# Altium schematic sheet Peripherals.SchDoc
size A3; SheetNumber: 3; SheetTotal: 5
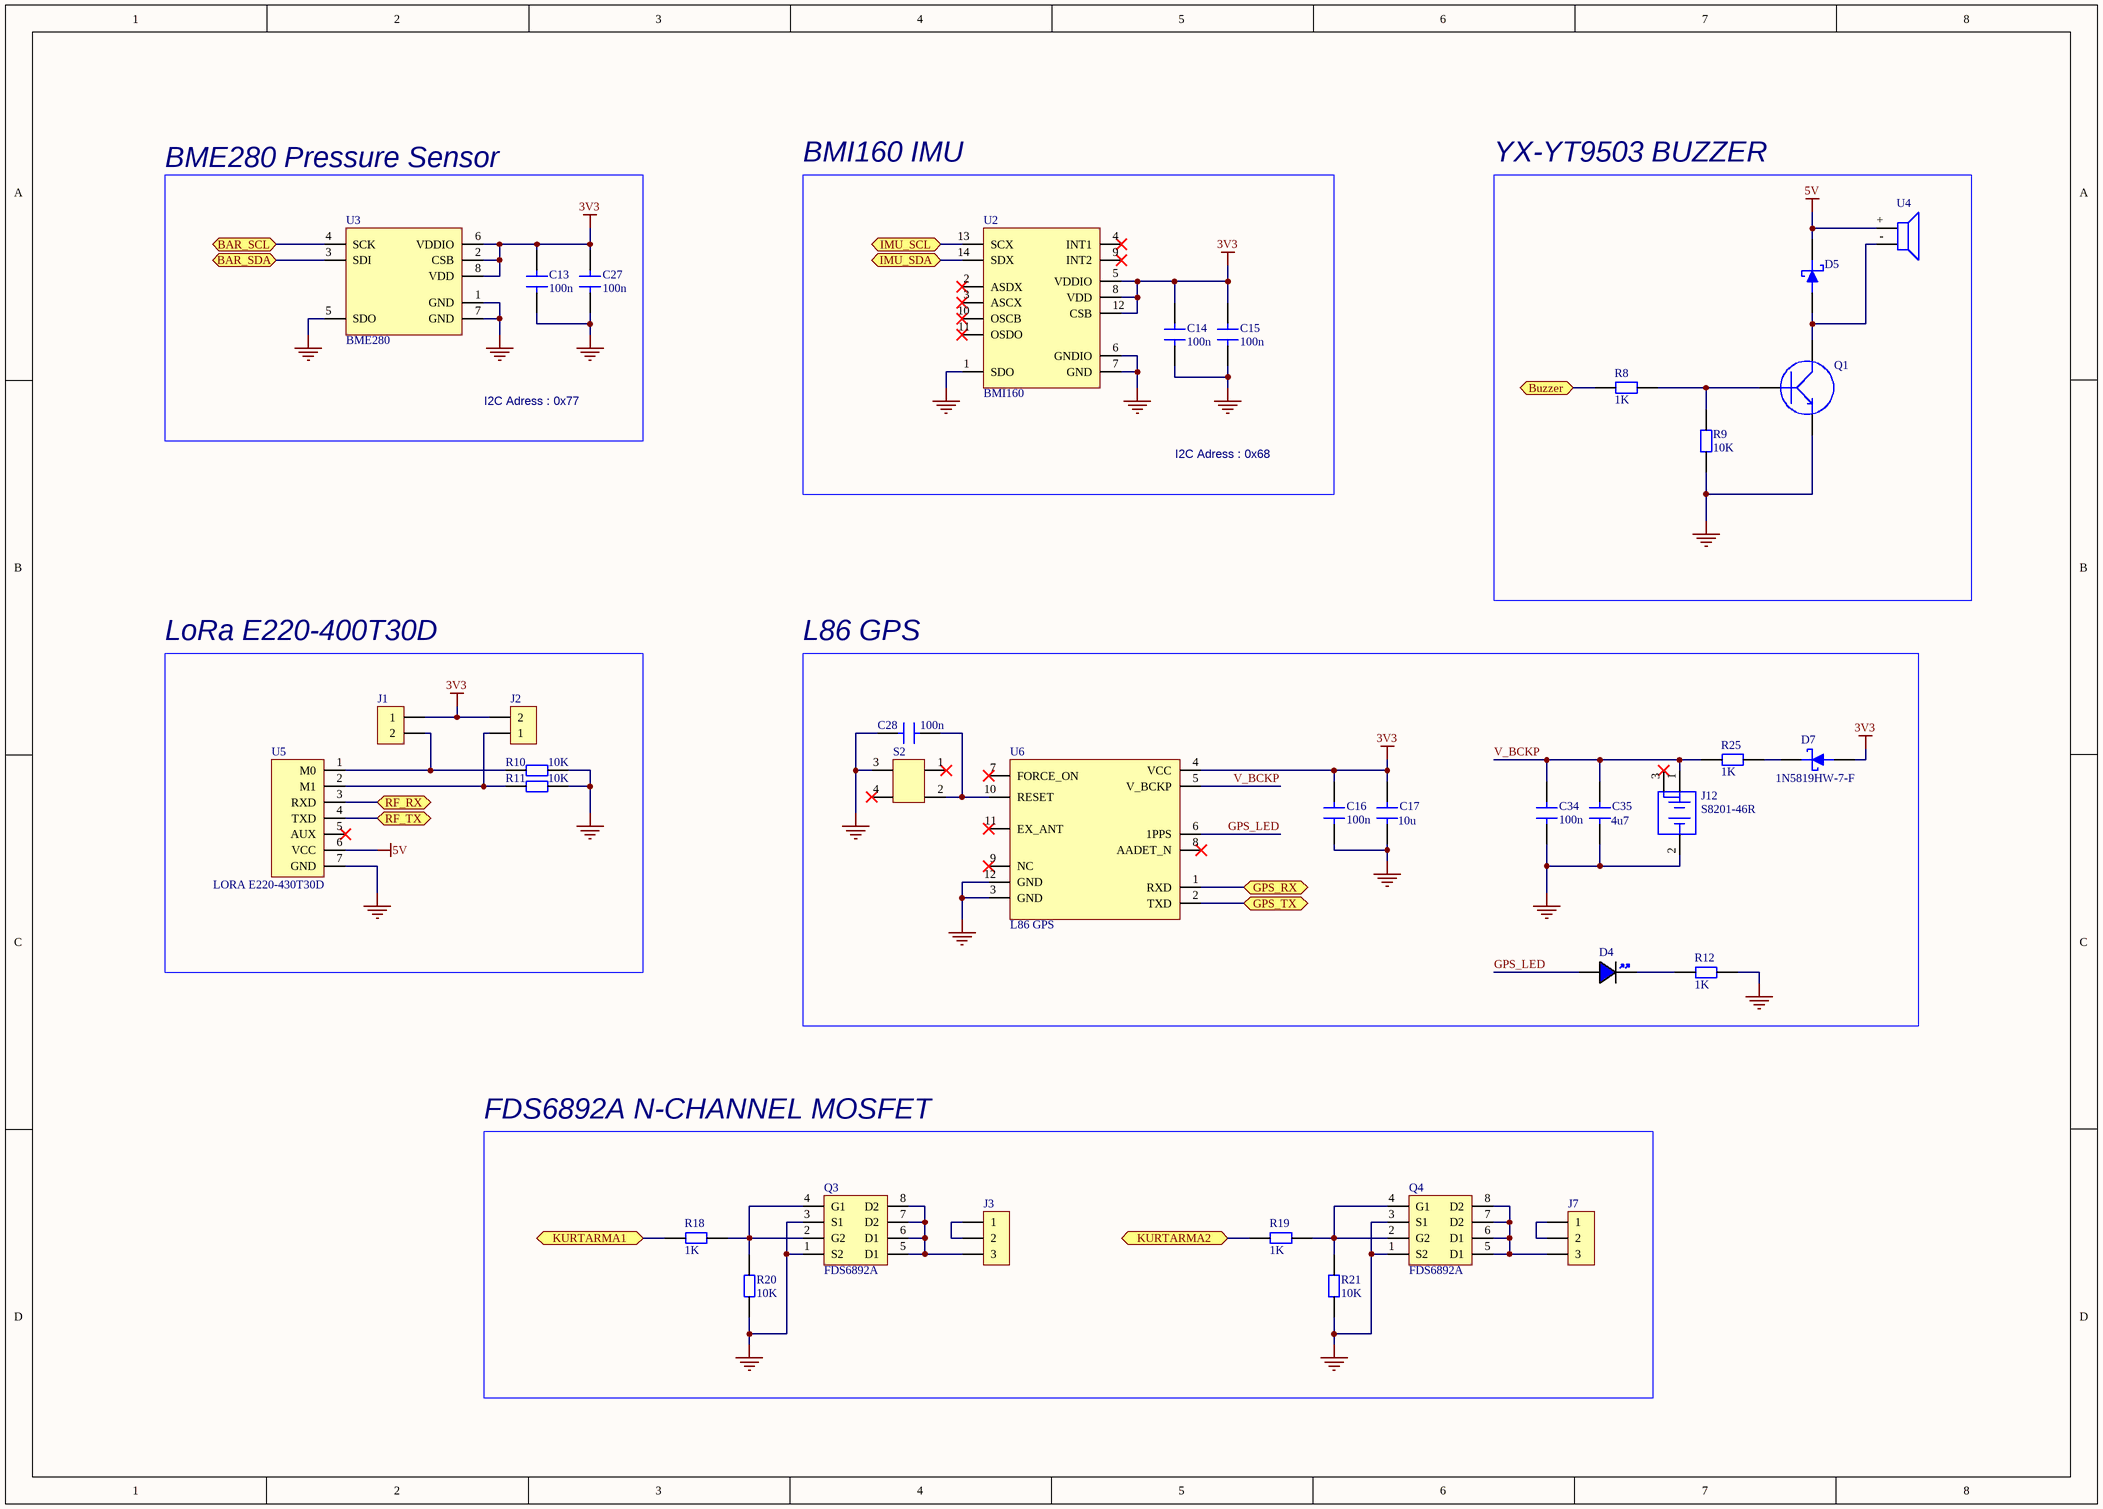
[diagram p0: Peripherals.SchDoc]

## Parts
C13  100n  [CAP 0603]
C14  100n  [CAP 0603]
C15  100n  [CAP 0603]
C16  100n  [CAP 0603]
C17  10u  [CAP 0805]
C27  100n  [CAP 0603]
C28  100n  [CAP 0603]
C34  100n  [CAP 0603]
C35  4u7  [CAP 0805]
D4  LED 0805 BLUE  [LED 0805 BLUE]  (value not drawn)
D5  TMBAT49FILM  [TMBAT49FILM]  (value not drawn)
D7  1N5819HW-7-F  [1N5819HW-7-F]
J1  1x2 HEADER MALE  [1x2 HEADER MALE]  (value not drawn)
J2  1x2 HEADER MALE  [1x2 HEADER MALE]  (value not drawn)
J3  JST B3B-XH-A  [JST_B3B-XH-A]  (value not drawn)
J7  JST B3B-XH-A  [JST_B3B-XH-A]  (value not drawn)
J12  S8201-46R  [S8201-46R]
Q1  BC817-25W,115  [BC817-25]  (value not drawn)
Q3  FDS6892A  [DMG4822SSD-13]
Q4  FDS6892A  [DMG4822SSD-13]
R8  1K  [RES 0603]
R9  10K  [RES 0603]
R10  10K  [RES 0603]
R11  10K  [RES 0603]
R12  1K  [RES 0603]
R18  1K  [RES 0805]
R19  1K  [RES 0805]
R20  10K  [RES 0805]
R21  10K  [RES 0805]
R25  1K  [RES 0603]
S2  FSM4JSMATR  [FSM4JSMATR]  (value not drawn)
U2  BMI160  [BMI160]
U3  BME280  [BME280]
U4  YX-YT9503  [YX-YT9503]  (value not drawn)
U5  LORA E220-430T30D  [LORA E220-400T30D]
U6  L86 GPS  [L86]

## Blocks framed on the sheet
BME280 Pressure Sensor: C13 C27 U3
BMI160 IMU: C14 C15 U2
YX-YT9503 BUZZER: D5 Q1 R8 R9 U4
LoRa E220-400T30D: J1 J2 R10 R11 U5
L86 GPS: C16 C17 C28 C34 C35 D4 D7 J12 R12 R25 S2 U6
FDS6892A N-CHANNEL MOSFET: J3 J7 Q3 Q4 R18-R21

## Ports
BAR_SCL (bidir, see Connectors[3C], MCU[4C]), BAR_SDA (bidir, see Connectors[3C], MCU[4C]), Buzzer (bidir, see MCU[4C]), GPS_RX (bidir, see MCU[4B]), GPS_TX (bidir, see MCU[4B]), IMU_SCL (bidir, see Connectors[4C], MCU[4C]), IMU_SDA (bidir, see Connectors[4C], MCU[3C]), KURTARMA1 (bidir, see MCU[3C]), KURTARMA2 (bidir, see MCU[3C]), RF_RX (bidir, see MCU[4B]), RF_TX (bidir, see MCU[4B])

## Nets
3V3: C13.2 C14.2 C15.2 C16.2 C17.2 C27.2 D7.C J1.1 J2.2 U2.5(VDDIO) U2.8(VDD) U2.12(CSB) U3.2(CSB) U3.6(VDDIO) U3.8(VDD) U6.4(VCC)
5V: D5.1 U4.+ U5.6(VCC)
GND: C13.1 C14.1 C15.1 C16.1 C17.1 C27.1 C28.1 C34.1 C35.1 J12.2(-) Q1.2(E) Q3.1(S2) Q3.3(S1) Q4.1(S2) Q4.3(S1) R9.1 R10.2 R11.2 R12.2 R20.1 R21.1 S2.3 U2.1(SDO) U2.6(GNDIO) U2.7(GND) U3.1(GND) U3.5(SDO) U3.7(GND) U5.7(GND) U6.3(GND) U6.12(GND)
BAR_SCL: U3.4(SCK) ; port BAR_SCL
BAR_SDA: U3.3(SDI) ; port BAR_SDA
Buzzer: R8.1 ; port Buzzer
GPS_LED: D4.A U6.6(1PPS)
GPS_RX: U6.1(RXD) ; port GPS_RX
GPS_TX: U6.2(TXD) ; port GPS_TX
IMU_SCL: U2.13(SCX) ; port IMU_SCL
IMU_SDA: U2.14(SDX) ; port IMU_SDA
KURTARMA1: R18.1 ; port KURTARMA1
KURTARMA2: R19.1 ; port KURTARMA2
RF_RX: U5.3(RXD) ; port RF_RX
RF_TX: U5.4(TXD) ; port RF_TX
V_BCKP: C34.2 C35.2 J12.1(+) R25.1 U6.5(V_BCKP)
NetC28_2: C28.2 S2.2 U6.10(RESET)
NetD4_K: D4.K R12.1
NetD5_2: D5.2 Q1.3(C) U4.-
NetD7_A: D7.A R25.2
NetJ1_2: J1.2 R10.1 U5.1(M0)
NetJ2_1: J2.1 R11.1 U5.2(M1)
NetJ3_1: J3.1 J3.2
NetJ3_3: J3.3 Q3.5(D1) Q3.6(D1) Q3.7(D2) Q3.8(D2)
NetJ7_1: J7.1 J7.2
NetJ7_3: J7.3 Q4.5(D1) Q4.6(D1) Q4.7(D2) Q4.8(D2)
NetQ1_1: Q1.1(B) R8.2 R9.2
NetQ3_2: Q3.2(G2) Q3.4(G1) R18.2 R20.2
NetQ4_2: Q4.2(G2) Q4.4(G1) R19.2 R21.2

Not connected (* = marked no-connect by the designer): J12 3(+)*; S2 1* 4*; U2 2(ASDX)* 3(ASCX)* 4(INT1)* 9(INT2)* 10(OSCB)* 11(OSDO)*; U5 5(AUX)*; U6 7(FORCE_ON)* 8(AADET_N)* 9(NC)* 11(EX_ANT)*

## Notes on the sheet
- I2C Adress : 0x77
- I2C Adress : 0x68

## Library data of the parts
C13-C16 C27 C28 C34 = CAP 0603 50V: Capacitor SMD 0603 50V
C17 C35 = CAP 0805 25V: Capacitor SMD 0805 25V
D4 = LED 0805 BLUE: LED 0805 GREEN SMD
D5 = TMBAT49FILM: Rectifier Diode Small Signal Schottky Si 80V 0.5A 2-Pin MELF T/R; Manufacturer: STMicroelectronics; Supplier 1: Mouser; Manufacturer Part Number: TMBAT49FILM; RoHS: Yes; Category: Rectifier Diodes; Stock 1: 11456; Pricing 1: 1=0,55, 10=0,468, 50=0,468, 100=0,326, 1000=0,228, 10000=0,159 (USD); ComponentLink1URL: https://datasheet.ciiva.com/4715/cd00000809-92451-4715102.pdf?src-supplier=Mouser; ComponentLink1Description: https://datasheet.ciiva.com/4715/cd00000809-92451-4715102.pdf?src-supplier=Mouser; ComponentLink2URL: https://datasheet.ciiva.com/16988/0900766b80db299a-16988744.pdf?src-supplier=Allied+Electronics; ComponentLink2Description: https://datasheet.ciiva.com/16988/0900766b80db299a-16988744.pdf?src-supplier=Allied+Electronics; ComponentLink3URL: https://datasheet.ciiva.com/22697/1766334-22697011.pdf?src-supplier=Element14; ComponentLink3Description: https://datasheet.ciiva.com/22697/1766334-22697011.pdf?src-supplier=Element14; ComponentLink4URL: https://datasheet.ciiva.com/16501/cd00000809-16501349.pdf?src-supplier=Future+Electronics; ComponentLink4Description: https://datasheet.ciiva.com/16501/cd00000809-16501349.pdf?src-supplier=Future+Electronics; ComponentLink5URL: https://datasheet.ciiva.com/15144/getdatasheetpartid-39750-15144086.pdf?src-supplier=Verical; ComponentLink5Description: https://datasheet.ciiva.com/15144/getdatasheetpartid-39750-15144086.pdf?src-supplier=Verical; ComponentLink6URL: https://datasheet.ciiva.com/915/cd00000809-915819.pdf?src-supplier=Digikey; ComponentLink6Description: https://datasheet.ciiva.com/915/cd00000809-915819.pdf?src-supplier=Digikey; ComponentLink7URL: https://datasheet.ciiva.com/915/cd00000809-915820.pdf?src-supplier=Digikey; ComponentLink7Description: https://datasheet.ciiva.com/915/cd00000809-915820.pdf?src-supplier=Digikey; ComponentLink8URL: https://datasheet.ciiva.com/915/cd00000809-915821.pdf?src-supplier=Digikey; ComponentLink8Description: https://datasheet.ciiva.com/915/cd00000809-915821.pdf?src-supplier=Digikey; ComponentLink9URL: https://datasheet.ciiva.com/7622/1766334-7622348.pdf?src-supplier=Element14; ComponentLink9Description: https://datasheet.ciiva.com/7622/1766334-7622348.pdf?src-supplier=Element14; ComponentLink10URL: https://datasheet.ciiva.com/7964/cd00000809-7964118.pdf?src-supplier=Element14; ComponentLink10Description: https://datasheet.ciiva.com/7964/cd00000809-7964118.pdf?src-supplier=Element14
D7 = 1N5819HW-7-F: Rectifier Diode, Schottky, 1 Phase, 1 Element, 1A, 40V V(RRM), Silicon; Manufacturer: Diodes; Max Reverse Current: 50uA; Peak Non-Repetitive Surge Current: 25A; Forward Voltage: 450mV; Max Power Dissipation: 450mW; Polarity: Standard; Capacitance: 50pF; Supplier 1: Future Electronics; Manufacturer Part Number: 1N5819HW-7-F; RoHS: Yes; Category: Rectifier Diodes; Stock 1: 5079000; Pricing 1: 3000=0,0409, 9000=0,0394, 15000=0,0388, 60000=0,037, 90000=0,0358 (USD); Case/Package: SOD-123-2; Number of Pins: 2; Weight: 0.000353oz; Min Operating Temperature: -65°C; Max Operating Temperature: 125°C; Forward Current: 1A; Max Repetitive Reverse Voltage (Vrrm): 40V; Package Quantity: 3000; Packaging: Tape and Reel; Average Rectified Current: 1A; Max Forward Surge Current (Ifsm): 25A; Termination: SMD/SMT; Voltage Rating (DC): 40V; Current Rating: 1A; Output Current: 1A; Max Reverse Voltage (DC): 40V; Series: -; Reverse Voltage: 40V; Length: 2.85mm; Width: 1.7mm; Height: 1.25mm; Radiation Hardening: No; Reach SVHC Compliant: No; Lead Free: Lead Free; RoHS Compliant: Yes; ComponentLink1URL: https://datasheet.ciiva.com/27092/1538419-27092484.pdf?src-supplier=Jameco; ComponentLink1Description: https://datasheet.ciiva.com/27092/1538419-27092484.pdf?src-supplier=Jameco; ComponentLink2URL: https://datasheet.ciiva.com/16303/ds30217-16303296.pdf?src-supplier=Future+Electronics; ComponentLink2Description: https://datasheet.ciiva.com/16303/ds30217-16303296.pdf?src-supplier=Future+Electronics; ComponentLink3URL: https://datasheet.ciiva.com/1177/ds30217-1177089.pdf?src-supplier=Element14; ComponentLink3Description: https://datasheet.ciiva.com/1177/ds30217-1177089.pdf?src-supplier=Element14; ComponentLink4URL: https://datasheet.ciiva.com/8303/ds30217-8303132.pdf?src-supplier=Avnet; ComponentLink4Description: https://datasheet.ciiva.com/8303/ds30217-8303132.pdf?src-supplier=Avnet; ComponentLink5URL: https://datasheet.ciiva.com/912/ds30217-912802.pdf?src-supplier=Digikey; ComponentLink5Description: https://datasheet.ciiva.com/912/ds30217-912802.pdf?src-supplier=Digikey; ComponentLink6URL: https://datasheet.ciiva.com/912/ds30217-912803.pdf?src-supplier=Digikey; ComponentLink6Description: https://datasheet.ciiva.com/912/ds30217-912803.pdf?src-supplier=Digikey; ComponentLink7URL: https://datasheet.ciiva.com/912/ds30217-912801.pdf?src-supplier=Digikey; ComponentLink7Description: https://datasheet.ciiva.com/912/ds30217-912801.pdf?src-supplier=Digikey
J3 J7 = JST B3B-XH-A: Connector Header, XH Series, 3 Position, 2.50mm, Through Hole, Press-Fit, Solder, Natural; Manufacturer Part Number: B3B-XH-A(LF)(SN); Supplier 1: CoreStaff; Manufacturer: JST; RoHS: Yes; Category: Headers and Wire Housings; Stock 1: 2101; Pricing 1: 1=39,94, 10=25,1, 50=21,68, 100=18,25, 500=17,57, 1000=17,12, 2000=16,44, 4000=15,79 (JPY); ComponentLink1URL: https://datasheet.ciiva.com/26894/getdatasheetpartid-640434-26894454.pdf?src-supplier=Verical; ComponentLink1Description: https://datasheet.ciiva.com/26894/getdatasheetpartid-640434-26894454.pdf?src-supplier=Verical; ComponentLink2URL: https://datasheet.ciiva.com/26894/getdatasheetpartid-440399-26894778.pdf?src-supplier=Verical; ComponentLink2Description: https://datasheet.ciiva.com/26894/getdatasheetpartid-440399-26894778.pdf?src-supplier=Verical; ComponentLink3URL: https://datasheet.ciiva.com/11746/0900766b8082653f-11746520.pdf?src-supplier=Rs; ComponentLink3Description: https://datasheet.ciiva.com/11746/0900766b8082653f-11746520.pdf?src-supplier=Rs
J12 = S8201-46R: Battery Holder, Coin Cell, 1225, Smd Rohs Compliant: Yes |Harwin S8201-46R; Manufacturer: Harwin; Number of Contacts: 2NUMBER; Supplier 1: Farnell; Manufacturer Part Number: S8201-46R; RoHS: Yes; Category: Connectors; Stock 1: 4494; Pricing 1: 1=0,926, 25=0,765, 75=0,589, 200=0,555, 500=0,48 (EUR); Contact Material: 153,154ConductorMaterial; Height: 3.25mm; ComponentLink1URL: https://datasheet.ciiva.com/4/s8201r-4048.pdf?src-supplier=Digikey; ComponentLink1Description: https://datasheet.ciiva.com/4/s8201r-4048.pdf?src-supplier=Digikey; ComponentLink2URL: https://datasheet.ciiva.com/4642/c0430120-20coin20cell20battery20retainers-55143-4642583.pdf?src-supplier=Mouser; ComponentLink2Description: https://datasheet.ciiva.com/4642/c0430120-20coin20cell20battery20retainers-55143-4642583.pdf?src-supplier=Mouser; ComponentLink3URL: https://datasheet.ciiva.com/1391/1458706-1391064.pdf?src-supplier=Element14; ComponentLink3Description: https://datasheet.ciiva.com/1391/1458706-1391064.pdf?src-supplier=Element14; ComponentLink4URL: https://datasheet.ciiva.com/4/s8201r-4049.pdf?src-supplier=Digikey; ComponentLink4Description: https://datasheet.ciiva.com/4/s8201r-4049.pdf?src-supplier=Digikey
Q1 = BC817-25W,115: BC817 Series 45 V 500 mA NPN General Purpose Transistor - SOT-23; Manufacturer: Nexperia; Supplier 1: Future Electronics; Manufacturer Part Number: BC817-25W,115; RoHS: Yes; Category: BJTs; Stock 1: 99000; Pricing 1: 3000=0,0169, 12000=0,0162, 45000=0,0155, 90000=0,0152, 225000=0,0144 (USD); ComponentLink1URL: https://datasheet.octopart.com/BC817-25W%2C115-NXP-datasheet-29749.pdf?src-supplier=Future+Electronics; ComponentLink1Description: https://datasheet.octopart.com/BC817-25W%2C115-NXP-datasheet-29749.pdf?src-supplier=Future+Electronics; ComponentLink2URL: http://www.farnell.com/datasheets/699988.pdf?src-supplier=Newark; ComponentLink2Description: http://www.farnell.com/datasheets/699988.pdf?src-supplier=Newark; ComponentLink3URL: https://datasheet.octopart.com/BC817-25W%2C115-Nexperia-datasheet-155782301.pdf?src-supplier=TME; ComponentLink3Description: https://datasheet.octopart.com/BC817-25W%2C115-Nexperia-datasheet-155782301.pdf?src-supplier=TME; Supplier Part Number 1: 5067352
Q3 Q4 = FDS6892A: Dual N-Channel Logic Level PWM Optimized PowerTrench® MOSFET 20V, 7.5A, 18mΩ; Manufacturer: ON Semiconductor / Fairchild; Supplier 1: Arrow Electronics; Manufacturer Part Number: FDS6892A; RoHS: Yes; Category: MOSFETs; Stock 1: 45; Pricing 1: 1=0,4552, 539=0,4077 (USD); ComponentLink1URL: https://datasheet.ciiva.com/15137/getdatasheetpartid-60185-15137252.pdf?src-supplier=Verical; ComponentLink1Description: https://datasheet.ciiva.com/15137/getdatasheetpartid-60185-15137252.pdf?src-supplier=Verical; ComponentLink2URL: https://datasheet.ciiva.com/8114/fds6892a-8114609.pdf?src-supplier=Avnet; ComponentLink2Description: https://datasheet.ciiva.com/8114/fds6892a-8114609.pdf?src-supplier=Avnet; ComponentLink3URL: https://datasheet.ciiva.com/6076/89392-6076006.pdf?src-supplier=Farnell; ComponentLink3Description: https://datasheet.ciiva.com/6076/89392-6076006.pdf?src-supplier=Farnell; ComponentLink4URL: https://datasheet.ciiva.com/4442/fds6892a-108922-4442276.pdf?src-supplier=Mouser; ComponentLink4Description: https://datasheet.ciiva.com/4442/fds6892a-108922-4442276.pdf?src-supplier=Mouser; ComponentLink5URL: https://datasheet.ciiva.com/16777/fds6892a-16777782.pdf?src-supplier=Future+Electronics; ComponentLink5Description: https://datasheet.ciiva.com/16777/fds6892a-16777782.pdf?src-supplier=Future+Electronics; ComponentLink6URL: https://datasheet.ciiva.com/6386/fds6892a-6386538.pdf?src-supplier=Digikey; ComponentLink6Description: https://datasheet.ciiva.com/6386/fds6892a-6386538.pdf?src-supplier=Digikey
R8-R12 R25 = RES 0603: Resistor SMD 0603
R18-R21 = RES 0805: Resistor SMD 0805
S2 = FSM4JSMATR: Switch Tactile OFF (ON) SPST Round Button Gull Wing 0.05A 24VDC 1.57N SMD T/R; Manufacturer: TE Connectivity Alcoswitch; Supplier 1: Digi-Key; Manufacturer Part Number: FSM4JSMATR; RoHS: Yes; Category: Pushbutton Switches; Stock 1: 84996; Pricing 1: 1=0,36, 10=0,351, 25=0,33, 100=0,2866, 250=0,26, 500=0,24188 (USD); ComponentLink1URL: https://datasheet.ciiva.com/16320/eng-cs-1308111-1-switches-core-program-catalog-0308-16320065.pdf?src-supplier=Future+Electronics; ComponentLink1Description: https://datasheet.ciiva.com/16320/eng-cs-1308111-1-switches-core-program-catalog-0308-16320065.pdf?src-supplier=Future+Electronics; ComponentLink2URL: https://datasheet.ciiva.com/1530/1683375-1530944.pdf?src-supplier=Element14; ComponentLink2Description: https://datasheet.ciiva.com/1530/1683375-1530944.pdf?src-supplier=Element14; ComponentLink3URL: https://datasheet.ciiva.com/23765/1486934-23765878.pdf?src-supplier=Newark; ComponentLink3Description: https://datasheet.ciiva.com/23765/1486934-23765878.pdf?src-supplier=Newark; ComponentLink4URL: https://datasheet.ciiva.com/7638/921681-7638037.pdf?src-supplier=Element14; ComponentLink4Description: https://datasheet.ciiva.com/7638/921681-7638037.pdf?src-supplier=Element14
U2 = BMI160: BMI160 2.5 x 3 mm Tiaxial Accelerometer / Gyroscope Inertial Measurement Unit; Manufacturer: Bosch Tools; Supplier 1: Digikey; Manufacturer Part Number: BMI160; RoHS: No; Category: Inertial Measurement Units (IMUs); ComponentLink1URL: https://ae-bst.resource.bosch.com/media/_tech/media/application_notes/BST-MIS-HS001.pdf?src-supplier=Digikey; ComponentLink1Description: https://ae-bst.resource.bosch.com/media/_tech/media/application_notes/BST-MIS-HS001.pdf?src-supplier=Digikey
U3 = BME280: SENSOR PRESSURE HUMIDITY TEMP; Manufacturer: Bosch; Sensor Type: Temperature; Output Type: SPI,I2C; Accuracy: 3%; Response Time: 1s; Supplier 1: Future Electronics; Manufacturer Part Number: BME280; RoHS: No; Category: Temperature and Humidity Sensors; Stock 1: 5185; Pricing 1: 1=6,1, 20=5,53, 150=5,14, 1000=4,78, 5000=4,48 (USD); Mount: Surface Mount; Case/Package: LGA; Number of Pins: 8; Min Operating Temperature: -40°C; Max Operating Temperature: 85°C; Packaging: Cut Tape; Lead Free: Lead Free; ComponentLink1URL: https://ae-bst.resource.bosch.com/media/_tech/media/datasheets/BST-BME280-DS002.pdf?src-supplier=Digi-Key; ComponentLink1Description: https://ae-bst.resource.bosch.com/media/_tech/media/datasheets/BST-BME280-DS002.pdf?src-supplier=Digi-Key; ComponentLink2URL: https://ae-bst.resource.bosch.com/media/_tech/media/product_flyer/BME280_Productflyer_BST_20170109.pdf?src-supplier=Mouser; ComponentLink2Description: https://ae-bst.resource.bosch.com/media/_tech/media/product_flyer/BME280_Productflyer_BST_20170109.pdf?src-supplier=Mouser; ComponentLink3URL: https://ae-bst.resource.bosch.com/media/_tech/media/product_flyer/BME280_Productflyer_BST_20170109.pdf?src-supplier=Arrow+Electronics; ComponentLink3Description: https://ae-bst.resource.bosch.com/media/_tech/media/product_flyer/BME280_Productflyer_BST_20170109.pdf?src-supplier=Arrow+Electronics; ComponentLink4URL: https://ae-bst.resource.bosch.com/media/_tech/media/product_flyer/BME280_Productflyer_BST_20170109.pdf?src-supplier=NAC+Semi; ComponentLink4Description: https://ae-bst.resource.bosch.com/media/_tech/media/product_flyer/BME280_Productflyer_BST_20170109.pdf?src-supplier=NAC+Semi
U4 = YX-YT9503: BUZZER MAGNETIC WITH CIRCUIT 3V 2.7-KHZ THT
U5 = LORA E220-430T30D: E220-400T30D LoRa Module